# Altium schematic sheet MARS_PORB.SchDoc: MAR_PORB.schDoc
size A4
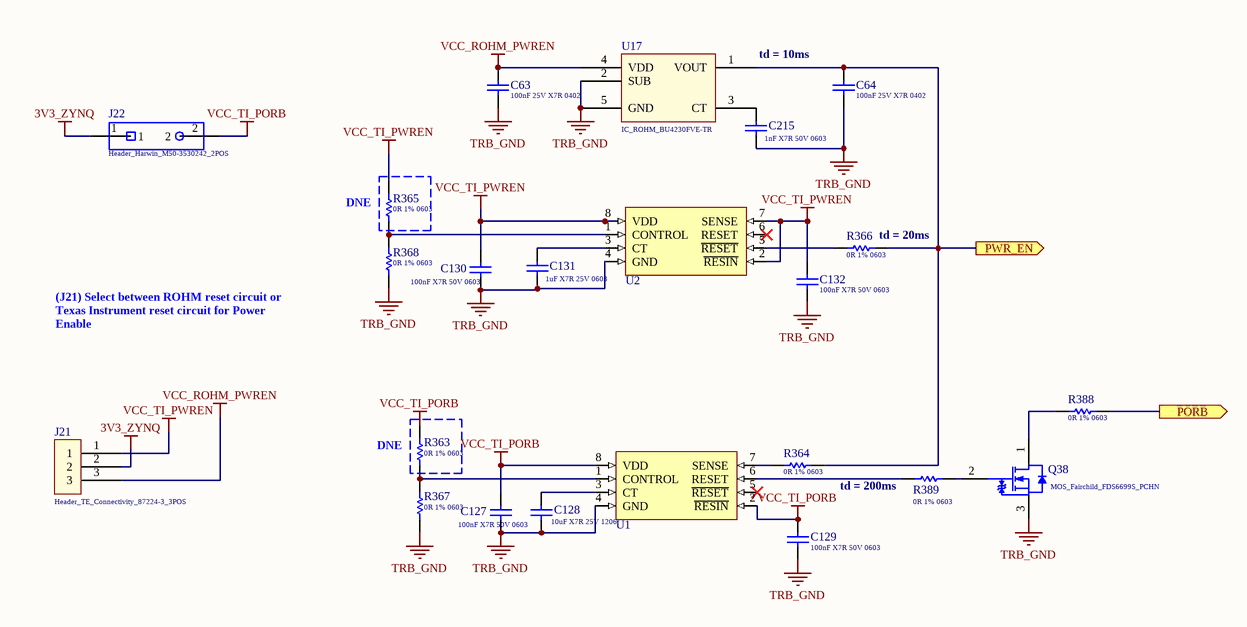
[diagram p0: MARS_PORB.SchDoc]

## Parts
C63  Capacitance: 100nF 25V X7R 0402  [Cap_Taiyo_Yuden_TMK105B7104KV-FR_100nF]  (hidden comment: Cap_Taiyo_Yuden_TMK105B7104KV-FR_100nF)
C64  Capacitance: 100nF 25V X7R 0402  [Cap_Taiyo_Yuden_TMK105B7104KV-FR_100nF]  (hidden comment: Cap_Taiyo_Yuden_TMK105B7104KV-FR_100nF)
C127  Capacitance: 100nF X7R 50V 0603  [Cap_Kemet_C0603C104M5RACAUTO_100nF]  (hidden comment: Cap_Kemet_C0603C104M5RACAUTO_100nF)
C128  Capacitance: 10uF X7R 25V 1206  [Cap_Murata_GRM31CR71E106MA12L_10uF]  (hidden comment: Cap_Murata_GRM31CR71E106MA12L_10uF)
C129  Capacitance: 100nF X7R 50V 0603  [Cap_Kemet_C0603C104M5RACAUTO_100nF]  (hidden comment: Cap_Kemet_C0603C104M5RACAUTO_100nF)
C130  Capacitance: 100nF X7R 50V 0603  [Cap_Kemet_C0603C104M5RACAUTO_100nF]  (hidden comment: Cap_Kemet_C0603C104M5RACAUTO_100nF)
C131  Capacitance: 1uF X7R 25V 0603  [Cap_Murata_GCJ188R71E105KA01J_1uF]  (hidden comment: Cap_Murata_GCJ188R71E105KA01J_1uF)
C132  Capacitance: 100nF X7R 50V 0603  [Cap_Kemet_C0603C104M5RACAUTO_100nF]  (hidden comment: Cap_Kemet_C0603C104M5RACAUTO_100nF)
C215  Capacitance: 1nF X7R 50V 0603  [Cap_Kemet_C0603C102J5RACAUTO_1nF]  (hidden comment: Cap_Kemet_C0603C102J5RACAUTO_1nF)
J21  Header_TE_Connectivity_87224-3_3POS  [Header_TE_Connectivity_87224-3_3POS]
J22  Header_Harwin_M50-3530242_2POS  [Header_Harwin_M50-3530242_2POS]
Q38  MOS_Fairchild_FDS6699S_PCHN  [MOS_Fairchild_FDS6699S_PCHN]
R363  Resistance: 0R 1% 0603  [Res_Vishay_CRCW06030000Z0EAHP_0_Ohm_duplicate]  (hidden comment: Res_Vishay_CRCW06030000Z0EAHP_0_Ohm)
R364  Resistance: 0R 1% 0603  [Res_Vishay_CRCW06030000Z0EAHP_0_Ohm_duplicate]  (hidden comment: Res_Vishay_CRCW06030000Z0EAHP_0_Ohm)
R365  Resistance: 0R 1% 0603  [Res_Vishay_CRCW06030000Z0EAHP_0_Ohm_duplicate]  (hidden comment: Res_Vishay_CRCW06030000Z0EAHP_0_Ohm)
R366  Resistance: 0R 1% 0603  [Res_Vishay_CRCW06030000Z0EAHP_0_Ohm_duplicate]  (hidden comment: Res_Vishay_CRCW06030000Z0EAHP_0_Ohm)
R367  Resistance: 0R 1% 0603  [Res_Vishay_CRCW06030000Z0EAHP_0_Ohm_duplicate]  (hidden comment: Res_Vishay_CRCW06030000Z0EAHP_0_Ohm)
R368  Resistance: 0R 1% 0603  [Res_Vishay_CRCW06030000Z0EAHP_0_Ohm_duplicate]  (hidden comment: Res_Vishay_CRCW06030000Z0EAHP_0_Ohm)
R388  Resistance: 0R 1% 0603  [Res_Vishay_CRCW06030000Z0EAHP_0_Ohm_duplicate]  (hidden comment: Res_Vishay_CRCW06030000Z0EAHP_0_Ohm)
R389  Resistance: 0R 1% 0603  [Res_Vishay_CRCW06030000Z0EAHP_0_Ohm_duplicate]  (hidden comment: Res_Vishay_CRCW06030000Z0EAHP_0_Ohm)
U1  PMU_Texas_Instruments_TLC7733IPWR_2.93  [PMU_Texas_Instruments_TLC7733IPWR_2.93]  (value not drawn)
U2  PMU_Texas_Instruments_TLC7733IPWR_2.93  [PMU_Texas_Instruments_TLC7733IPWR_2.93]  (value not drawn)
U17  IC_ROHM_BU4230FVE-TR  [IC_ROHM_BU4230FVE-TR]

## Ports
PORB (out), PWR_EN (out)

## Nets
3V3_ZYNQ: J21.2 J22.1
TRB_GND: C63.1 C64.2 C127.2 C128.2 C129.2 C130.2 C131.1 C132.2 C215.1 Q38.3(S) R367.1 R368.1 U1.4(GND) U2.4(GND) U17.2(SUB) U17.5(GND)
VCC_ROHM_PWREN: C63.2 J21.3 U17.4(VDD)
VCC_TI_PORB: C127.1 C129.1 J22.2 R363.2 U1.2(~{RESIN}) U1.8(VDD)
VCC_TI_PWREN: C130.1 C132.1 J21.1 R365.1 U2.2(~{RESIN}) U2.7(SENSE) U2.8(VDD)
PORB: R388.1 ; port PORB
PWR_EN: C64.1 R364.1 R366.1 U17.1(VOUT) ; port PWR_EN
NetC128_1: C128.1 U1.3(CT)
NetC131_2: C131.2 U2.3(CT)
NetC215_2: C215.2 U17.3(CT)
NetQ38_1: Q38.1(D) R388.2
NetQ38_2: Q38.2(G) R389.1
NetR363_1: R363.1 R367.2 U1.1(CONTROL)
NetR364_2: R364.2 U1.7(SENSE)
NetR365_2: R365.2 R368.2 U2.1(CONTROL)
NetR366_2: R366.2 U2.5(~{RESET})
NetR389_2: R389.2 U1.6(RESET)

Not connected (* = marked no-connect by the designer): U1 5(~{RESET})*; U2 6(RESET)*

## Notes on the sheet
- td = 10ms
- (near R365) DNE
- (near R366) td = 20ms
- (J21) Select between ROHM reset circuit or
  Texas Instrument reset circuit for Power Enable
- (near R363) DNE
- (near R389) td = 200ms

## Library data of the parts
C63 C64 = Cap_Taiyo_Yuden_TMK105B7104KV-FR_100nF: CAP CER 100nF 25V X7R 0402; Supplier 1: Mouser; Supplier Part Number 1: 963-TMK105B7104KV-FR
C127 C129 C130 C132 = Cap_Kemet_C0603C104M5RACAUTO_100nF: CAP CER 100nF 50V X7R 0603; Supplier 1: Mouser; Supplier Part Number 1: 80-C0603C104M5RAUTO
C128 = Cap_Murata_GRM31CR71E106MA12L_10uF: CAP CER 10uF 25V X7R 1206; Supplier 1: Mouser; Supplier Part Number 1: 81-GRM31CR71E106MA2L
C131 = Cap_Murata_GCJ188R71E105KA01J_1uF: CAP CER 1uF 25V X7R 0603; Supplier 1: Mouser; Supplier Part Number 1: 81-GCJ188R71E105KA1J
C215 = Cap_Kemet_C0603C102J5RACAUTO_1nF: CAP CER 1nF 50V X7R 0603; Supplier 1: Mouser; Supplier Part Number 1: 80-C0603C102J5RAUTO
J21 = Header_TE_Connectivity_87224-3_3POS: Headers & Wire Housings UNSHRD VERT SNGL 3; Supplier 1: Mouser; Supplier Part Number 1: 571-872243
J22 = Header_Harwin_M50-3530242_2POS: Headers & Wire Housings 2 WAY SIL VERT PC TAIL P/HDR; Supplier 1: Mouser; Supplier Part Number 1: 855-M50-3530242
Q38 = MOS_Fairchild_FDS6699S_PCHN: MOSFET 30V N-Ch PowerTrench SyncFET
R363-R368 R388 R389 = Res_Vishay_CRCW06030000Z0EAHP_0_Ohm: 0R 0.25W 1% 0603 (1608 Metric)  SMD; Supplier 1: Mouser; Supplier Part Number 1: 71-CRCW06030000Z0EAH
U1 U2 = PMU_Texas_Instruments_TLC7733IPWR_2.93: Supervisory Circuits 2.93V Monitor
U17 = IC_ROHM_BU4230FVE-TR: Supervisory Circuits LOW VOLT DETECT VOL; Supplier 1: Mouser; Supplier Part Number 1: BU4230FVE-TR